# Altium schematic sheet FLASH_CSI.SchDoc
size A4; SheetNumber: 3; SheetTotal: 5
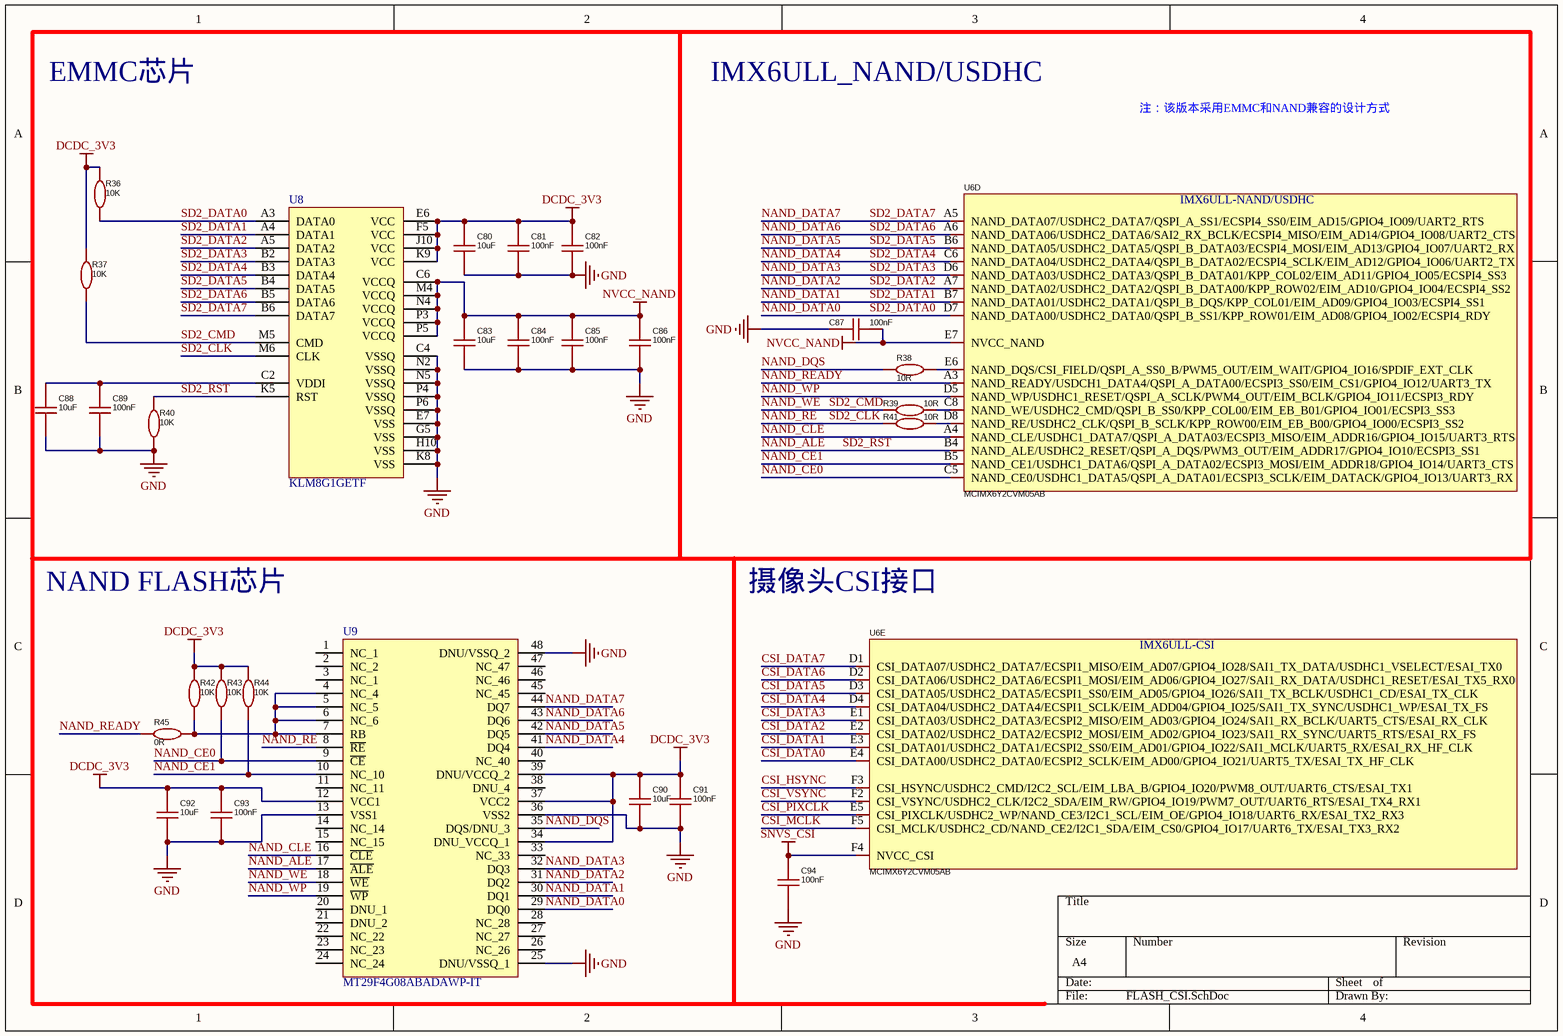
[diagram p0: FLASH_CSI.SchDoc]

## Parts
C80  10uF  [C0402]
C81  100nF  [C0402]
C82  100nF  [C0402]
C83  10uF  [C0402]
C84  100nF  [C0402]
C85  100nF  [C0402]
C86  100nF  [C0402]
C87  100nF  [C0402]
C88  10uF  [C0402]
C89  100nF  [C0402]
C90  10uF  [C0402]
C91  100nF  [C0402]
C92  10uF  [C0402]
C93  100nF  [C0402]
C94  100nF  [C0402]
R36  10K  [R0402]
R37  10K  [R0402]
R38  10R  [R0402]
R39  10R  [R0402]
R40  10K  [R0402]
R41  10R  [R0402]
R42  10K  [R0402]
R43  10K  [R0402]
R44  10K  [R0402]
R45  0R  [R0402]
U6  MCIMX6Y2CVM05AB  [BGA-289_L14.0-W14.0-R17-C17-P0.80-BL]  (parts D,E of 12)
U8  KLM8G1GETF  [BGA169  EMMC]
U9  MT29F4G08ABADAWP-IT  [TSOP48]

## Blocks framed on the sheet
EMMC芯片: C80-C86 C88 C89 R36 R37 R40 U8

## Nets
DCDC_3V3: C80.2 C81.2 C82.2 C90.2 C91.2 C92.2 C93.2 R36.2 R37.2 R42.2 R43.2 R44.2 U8.E6(VCC) U8.F5(VCC) U8.J10(VCC) U8.K9(VCC) U9.12(VCC1) U9.34(DNU_VCCQ_1) U9.37(VCC2) U9.39(DNU/VCCQ_2)
GND: C80.1 C81.1 C82.1 C83.1 C84.1 C85.1 C86.1 C87.1 C88.1 C89.1 C90.1 C91.1 C92.1 C93.1 C94.1 R40.1 U8.C4(VSSQ) U8.E7(VSS) U8.G5(VSS) U8.H10(VSS) U8.K8(VSS) U8.N2(VSSQ) U8.N5(VSSQ) U8.P4(VSSQ) U8.P6(VSSQ) U9.13(VSS1) U9.25(DNU/VSSQ_1) U9.36(VSS2) U9.48(DNU/VSSQ_2)
NVCC_NAND: C83.2 C84.2 C85.2 C86.2 C87.2 U6.E7(NVCC_NAND) U8.C6(VCCQ) U8.M4(VCCQ) U8.N4(VCCQ) U8.P3(VCCQ) U8.P5(VCCQ)
SNVS_CSI: C94.2 U6.F4(NVCC_CSI)
CSI_DATA0: U6.E4(CSI_DATA00/USDHC2_DATA0/ECSPI2_SCLK/EIM_AD00/GPIO4_IO21/UART5_TX/ESAI_TX_HF_CLK)
CSI_DATA1: U6.E3(CSI_DATA01/USDHC2_DATA1/ECSPI2_SS0/EIM_AD01/GPIO4_IO22/SAI1_MCLK/UART5_RX/ESAI_RX_HF_CLK)
CSI_DATA2: U6.E2(CSI_DATA02/USDHC2_DATA2/ECSPI2_MOSI/EIM_AD02/GPIO4_IO23/SAI1_RX_SYNC/UART5_RTS/ESAI_RX_FS)
CSI_DATA3: U6.E1(CSI_DATA03/USDHC2_DATA3/ECSPI2_MISO/EIM_AD03/GPIO4_IO24/SAI1_RX_BCLK/UART5_CTS/ESAI_RX_CLK)
CSI_DATA4: U6.D4(CSI_DATA04/USDHC2_DATA4/ECSPI1_SCLK/EIM_ADD04/GPIO4_IO25/SAI1_TX_SYNC/USDHC1_WP/ESAI_TX_FS)
CSI_DATA5: U6.D3(CSI_DATA05/USDHC2_DATA5/ECSPI1_SS0/EIM_AD05/GPIO4_IO26/SAI1_TX_BCLK/USDHC1_CD/ESAI_TX_CLK)
CSI_DATA6: U6.D2(CSI_DATA06/USDHC2_DATA6/ECSPI1_MOSI/EIM_AD06/GPIO4_IO27/SAI1_RX_DATA/USDHC1_RESET/ESAI_TX5_RX0)
CSI_DATA7: U6.D1(CSI_DATA07/USDHC2_DATA7/ECSPI1_MISO/EIM_AD07/GPIO4_IO28/SAI1_TX_DATA/USDHC1_VSELECT/ESAI_TX0)
CSI_HSYNC: U6.F3(CSI_HSYNC/USDHC2_CMD/I2C2_SCL/EIM_LBA_B/GPIO4_IO20/PWM8_OUT/UART6_CTS/ESAI_TX1)
CSI_MCLK: U6.F5(CSI_MCLK/USDHC2_CD/NAND_CE2/I2C1_SDA/EIM_CS0/GPIO4_IO17/UART6_TX/ESAI_TX3_RX2)
CSI_PIXCLK: U6.E5(CSI_PIXCLK/USDHC2_WP/NAND_CE3/I2C1_SCL/EIM_OE/GPIO4_IO18/UART6_RX/ESAI_TX2_RX3)
CSI_VSYNC: U6.F2(CSI_VSYNC/USDHC2_CLK/I2C2_SDA/EIM_RW/GPIO4_IO19/PWM7_OUT/UART6_RTS/ESAI_TX4_RX1)
NAND_ALE: R40.2 U6.B4(NAND_ALE/USDHC2_RESET/QSPI_A_DQS/PWM3_OUT/EIM_ADDR17/GPIO4_IO10/ECSPI3_SS1) U8.K5(RST) U9.17(~{ALE})  [also labelled SD2_RST]
NAND_CE0: R43.1 U6.C5(NAND_CE0/USDHC1_DATA5/QSPI_A_DATA01/ECSPI3_SCLK/EIM_DATACK/GPIO4_IO13/UART3_RX) U9.9(~{CE})
NAND_CE1: R44.1 U6.B5(NAND_CE1/USDHC1_DATA6/QSPI_A_DATA02/ECSPI3_MOSI/EIM_ADDR18/GPIO4_IO14/UART3_CTS) U9.10(NC_10)
NAND_CLE: U6.A4(NAND_CLE/USDHC1_DATA7/QSPI_A_DATA03/ECSPI3_MISO/EIM_ADDR16/GPIO4_IO15/UART3_RTS) U9.16(~{CLE})
NAND_DATA0: R36.1 U6.D7(NAND_DATA00/USDHC2_DATA0/QSPI_B_SS1/KPP_ROW01/EIM_AD08/GPIO4_IO02/ECSPI4_RDY) U8.A3(DATA0) U9.29(DQ0)  [also labelled SD2_DATA0]
NAND_DATA1: U6.B7(NAND_DATA01/USDHC2_DATA1/QSPI_B_DQS/KPP_COL01/EIM_AD09/GPIO4_IO03/ECSPI4_SS1) U8.A4(DATA1) U9.30(DQ1)  [also labelled SD2_DATA1]
NAND_DATA2: U6.A7(NAND_DATA02/USDHC2_DATA2/QSPI_B_DATA00/KPP_ROW02/EIM_AD10/GPIO4_IO04/ECSPI4_SS2) U8.A5(DATA2) U9.31(DQ2)  [also labelled SD2_DATA2]
NAND_DATA3: U6.D6(NAND_DATA03/USDHC2_DATA3/QSPI_B_DATA01/KPP_COL02/EIM_AD11/GPIO4_IO05/ECSPI4_SS3) U8.B2(DATA3) U9.32(DQ3)  [also labelled SD2_DATA3]
NAND_DATA4: U6.C6(NAND_DATA04/USDHC2_DATA4/QSPI_B_DATA02/ECSPI4_SCLK/EIM_AD12/GPIO4_IO06/UART2_TX) U8.B3(DATA4) U9.41(DQ4)  [also labelled SD2_DATA4]
NAND_DATA5: U6.B6(NAND_DATA05/USDHC2_DATA5/QSPI_B_DATA03/ECSPI4_MOSI/EIM_AD13/GPIO4_IO07/UART2_RX) U8.B4(DATA5) U9.42(DQ5)  [also labelled SD2_DATA5]
NAND_DATA6: U6.A6(NAND_DATA06/USDHC2_DATA6/SAI2_RX_BCLK/ECSPI4_MISO/EIM_AD14/GPIO4_IO08/UART2_CTS) U8.B5(DATA6) U9.43(DQ6)  [also labelled SD2_DATA6]
NAND_DATA7: U6.A5(NAND_DATA07/USDHC2_DATA7/QSPI_A_SS1/ECSPI4_SS0/EIM_AD15/GPIO4_IO09/UART2_RTS) U8.B6(DATA7) U9.44(DQ7)  [also labelled SD2_DATA7]
NAND_DQS: R38.1 U9.35(DQS/DNU_3)
NAND_RE: R41.1 U8.M6(CLK) U9.8(~{RE})  [also labelled SD2_CLK]
NAND_READY: R45.2 U6.A3(NAND_READY/USDCH1_DATA4/QSPI_A_DATA00/ECSPI3_SS0/EIM_CS1/GPIO4_IO12/UART3_TX)
NAND_WE: R37.1 R39.1 U8.M5(CMD) U9.18(~{WE})  [also labelled SD2_CMD]
NAND_WP: U6.D5(NAND_WP/USDHC1_RESET/QSPI_A_SCLK/PWM4_OUT/EIM_BCLK/GPIO4_IO11/ECSPI3_RDY) U9.19(~{WP})
NetC88_2: C88.2 C89.2 U8.C2(VDDI)
NetR38_2: R38.2 U6.E6(NAND_DQS/CSI_FIELD/QSPI_A_SS0_B/PWM5_OUT/EIM_WAIT/GPIO4_IO16/SPDIF_EXT_CLK)
NetR39_2: R39.2 U6.C8(NAND_WE/USDHC2_CMD/QSPI_B_SS0/KPP_COL00/EIM_EB_B01/GPIO4_IO01/ECSPI3_SS3)
NetR41_2: R41.2 U6.D8(NAND_RE/USDHC2_CLK/QSPI_B_SCLK/KPP_ROW00/EIM_EB_B00/GPIO4_IO00/ECSPI3_SS2)
NetR42_1: R42.1 R45.1 U9.4(NC_4) U9.5(NC_5) U9.6(NC_6) U9.7(RB)

Not connected (* = marked no-connect by the designer): U9 1(NC_1) 2(NC_2) 3(NC_1) 11(NC_11) 14(NC_14) 15(NC_15) 20(DNU_1) 21(DNU_2) 22(NC_22) 23(NC_23) 24(NC_24) 26(NC_26) 27(NC_27) 28(NC_28) 33(NC_33) 38(DNU_4) 40(NC_40) 45(NC_45) 46(NC_46) 47(NC_47)

## Notes on the sheet
- IMX6ULL_NAND/USDHC
- 注：该版本采用EMMC和NAND兼容的设计方式
- NAND FLASH芯片
- 摄像头CSI接口
- (in symbol MCIMX6Y2CVM05AB, part D) IMX6ULL-NAND/USDHC
- (in symbol MCIMX6Y2CVM05AB, part E) IMX6ULL-CSI

## Library data of the parts
C80 C83 C88 C90 C92 = C0402: 容值:100nF;精度:±10%;额定电压:50V;材质(温度系数):X7R;; Manufacturer: muRata(村田); Symbol: GRM155R71H104KE14D; Add into BOM: yes; Value: 100nF; Tolerance: ±10%; Voltage Rated: 50V; Temperature Coefficient: X7R; Device: GRM155R71H104KE14D; LCSC Part Name: 100nF ±10% 50V; Supplier Part: C77020; Manufacturer Part: GRM155R71H104KE14D; Supplier Footprint: 0402; JLCPCB Part Class: 扩展库; Datasheet: https://atta.szlcsc.com/upload/public/pdf/source/20180326/C77020_39BD49C951FF1AF0DB1F1FAC5AC1E401.pdf; Supplier: LCSC; Convert to PCB: yes
C81 C82 C84-C87 C89 C91 C93 C94 = C0402: 容值:100nF;精度:±10%;额定电压:50V;材质(温度系数):X7R;; Manufacturer: muRata(村田); Symbol: GRM155R71H104KE14D; Add into BOM: yes; Tolerance: ±10%; Voltage Rated: 50V; Temperature Coefficient: X7R; Device: GRM155R71H104KE14D; LCSC Part Name: 100nF ±10% 50V; Supplier Part: C77020; Manufacturer Part: GRM155R71H104KE14D; Supplier Footprint: 0402; JLCPCB Part Class: 扩展库; Datasheet: https://atta.szlcsc.com/upload/public/pdf/source/20180326/C77020_39BD49C951FF1AF0DB1F1FAC5AC1E401.pdf; Supplier: LCSC; Convert to PCB: yes; Value: 100nF
R36-R45 = R0402: 电阻类型:厚膜电阻;阻值:1kΩ;精度:±1%;功率:62.5mW;最大工作电压:50V;温度系数:±100ppm/℃;; Manufacturer: UNI-ROYAL(厚声); Symbol: 0402WGF1001TCE; Add into BOM: yes; Value: 1kΩ; Tolerance: ±1%; Power(Watts): 62.5mW; Overload Voltage (Max): 50V; Device: 0402WGF1001TCE; LCSC Part Name: 1kΩ ±1% 62.5mW 厚膜电阻; Supplier Part: C11702; Manufacturer Part: 0402WGF1001TCE; Supplier Footprint: 0402; JLCPCB Part Class: 基础库; Datasheet: https://atta.szlcsc.com/upload/public/pdf/source/20200306/C422600_1E6D84923E4A46A82E41ADD87F860B5C.pdf; Supplier: LCSC; Convert to PCB: yes; Type: 厚膜电阻; Temperature Coefficient: ±100ppm/℃; Operating Temperature Range: -55℃~+155℃
U6 = MCIMX6Y2CVM05AB: CPU内核:ARM-A系列;RAM总容量:128KB;GPIO端口数量:-;工作电压范围:-;CPU最大主频:528MHz;程序存储器类型:-;应用领域:-;; Manufacturer: NXP(恩智浦); Add into BOM: yes; RAM Size: 128KB; CPU Maximum Speed: 528MHz; ADC (Bit): 12bit; UART/USART: 8; I2C: 4; Universal Serial Bus: 有; Peripheral/Function: 真随机数发生器; Symbol: MCIMX6Y2CVM05AB; Device: MCIMX6Y2CVM05AB; LCSC Part Name: MCIMX6Y2CVM05AB; Supplier Part: C394783; Manufacturer Part: MCIMX6Y2CVM05AB; Supplier Footprint: MAPBGA-289(14x14); JLCPCB Part Class: 扩展库; Datasheet: https://atta.szlcsc.com/upload/public/pdf/source/20190903/C414057_F91A491E37DFDD32A6FE61E7D0CA74B1.pdf; Supplier: LCSC; Convert to PCB: yes; CPU Core: ARM-A系列; GPIO Ports Number: -; Operating Voltage Range: -; Program Memory Type: -; Operating Temperature Range: -40℃~+105℃; DAC (Bit): -; PWM (Bit): -; 8Bit Timer: -; 16Bit Timer: -; 32Bit Timer: -; CAN: -; I2S: -; SPI: 4; Internal Comparator: -; communication protocol: -; Watchdog: -; Real-Time Clock: -; Infrared Data Association: -; Low-Voltage Detect: -; CCP Capture/Compare: -; LCD Module: 有; LED Module: -; Secure Digital Input and Output: -; Direct Memory Access: -; Internal Oscillator: -; Application Area: -
U8 = THGBM4G5D1HBAIR/4GB
U9 = MT29F16G16G08CBACA